# Altium schematic sheet SCH_A2_Temp.SchDoc
size A2
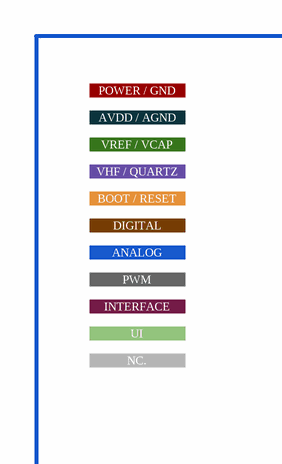
[diagram p0: SCH_A2_Temp.SchDoc, top left]
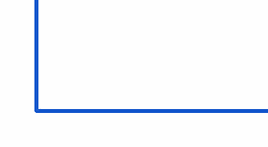
[diagram p1: SCH_A2_Temp.SchDoc, bottom left]

## Ports
ANALOG, AVDD / AGND, BOOT / RESET, DIGITAL, INTERFACE, NC., POWER / GND, PWM, UI, VHF / QUARTZ, VREF / VCAP